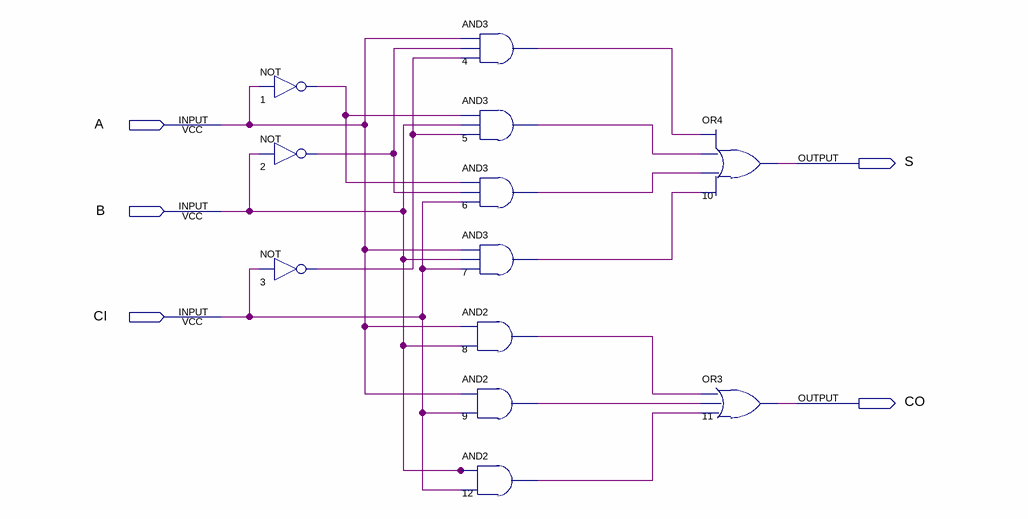
[diagram p0: schematic sheet]
// Quartus schematic add1bit.bdf as structural Verilog: 12 symbols, 5 pins
module add1bit (
  input  A,
  input  B,
  input  CI,
  output S,
  output CO
);

  wire n1_out, n2_out, n3_out, n4_out, n5_out, n6_out, n7_out, n8_out, n9_out, n12_out;

  not u_1 (n1_out, A);
  not u_2 (n2_out, B);
  not u_3 (n3_out, CI);
  and u_4 (n4_out, A, n2_out, n3_out);
  and u_5 (n5_out, n1_out, B, n3_out);
  and u_6 (n6_out, n1_out, n2_out, CI);
  and u_7 (n7_out, A, B, CI);
  and u_8 (n8_out, A, B);
  and u_9 (n9_out, A, CI);
  and u_12 (n12_out, B, CI);
  or u_10 (S, n4_out, n5_out, n6_out, n7_out);
  or u_11 (CO, n8_out, n9_out, n12_out);
endmodule
